# Altium schematic sheet ddr3.SchDoc
size A4; SheetNumber: 1; SheetTotal: 7
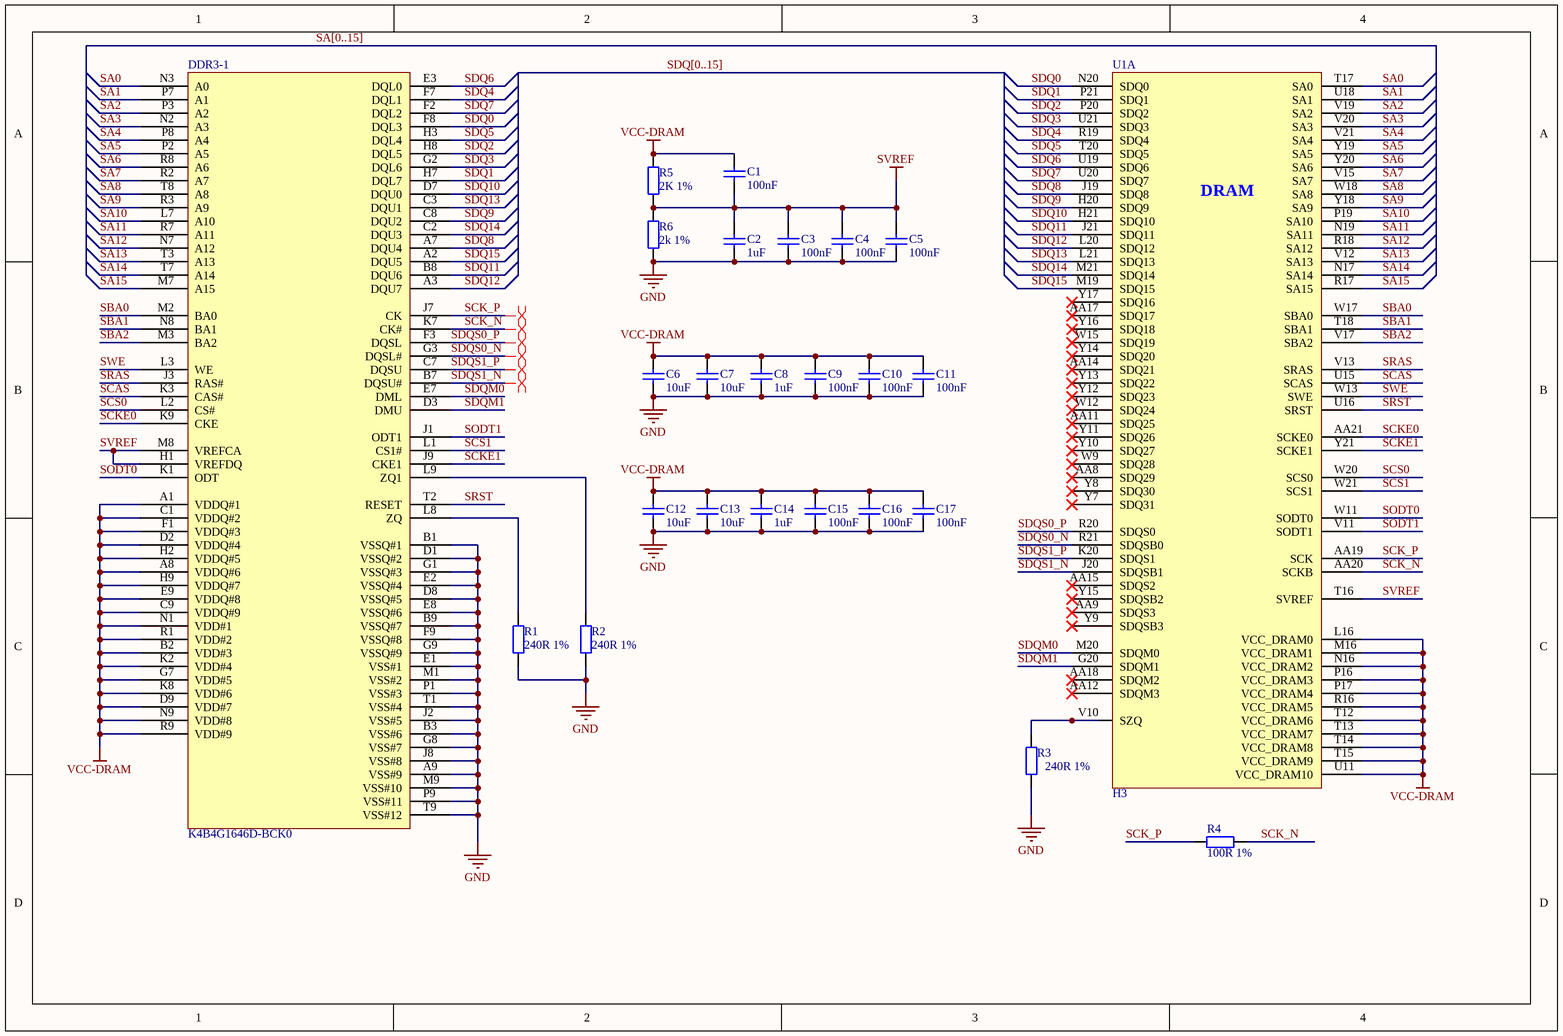
[diagram p0: ddr3.SchDoc]

## Parts
C1  100nF  [0402_C]
C2  1uF  [0402_C]
C3  100nF  [0402_C]
C4  100nF  [0402_C]
C5  100nF  [0402_C]
C6  10uF  [0402_C]
C7  10uF  [0402_C]
C8  1uF  [0402_C]
C9  100nF  [0402_C]
C10  100nF  [0402_C]
C11  100nF  [0402_C]
C12  10uF  [0402_C]
C13  10uF  [0402_C]
C14  1uF  [0402_C]
C15  100nF  [0402_C]
C16  100nF  [0402_C]
C17  100nF  [0402_C]
DDR3-1  K4B4G1646D-BCK0  [BGA96_DDR3]
R1  240R 1%  [0402_R]
R2  240R 1%  [0402_R]
R3  240R 1%  [0402_R]
R4  100R 1%  [0402_R]
R5  2K 1%  [0402_R]
R6  2k 1%  [0402_R]
U1  H3  [allwinner-h3]  (part A of 9)

## Nets
GND: C2.2 C3.2 C4.2 C5.2 C6.2 C7.2 C8.2 C9.2 C10.2 C11.2 C12.2 C13.2 C14.2 C15.2 C16.2 C17.2 DDR3-1.A9(VSS#9) DDR3-1.B1(VSSQ#1) DDR3-1.B3(VSS#6) DDR3-1.B9(VSSQ#7) DDR3-1.D1(VSSQ#2) DDR3-1.D8(VSSQ#5) DDR3-1.E1(VSS#1) DDR3-1.E2(VSSQ#4) DDR3-1.E8(VSSQ#6) DDR3-1.F9(VSSQ#8) DDR3-1.G1(VSSQ#3) DDR3-1.G8(VSS#7) DDR3-1.G9(VSSQ#9) DDR3-1.J2(VSS#5) DDR3-1.J8(VSS#8) DDR3-1.M1(VSS#2) DDR3-1.M9(VSS#10) DDR3-1.P1(VSS#3) DDR3-1.P9(VSS#11) DDR3-1.T1(VSS#4) DDR3-1.T9(VSS#12) R1.1 R2.1 R3.1 R6.2
SVREF: C1.2 C2.1 C3.1 C4.1 C5.1 DDR3-1.H1(VREFDQ) DDR3-1.M8(VREFCA) R5.1 R6.1 U1.T16(SVREF)
VCC-DRAM: C1.1 C6.1 C7.1 C8.1 C9.1 C10.1 C11.1 C12.1 C13.1 C14.1 C15.1 C16.1 C17.1 DDR3-1.A1(VDDQ#1) DDR3-1.A8(VDDQ#6) DDR3-1.B2(VDD#3) DDR3-1.C1(VDDQ#2) DDR3-1.C9(VDDQ#9) DDR3-1.D2(VDDQ#4) DDR3-1.D9(VDD#7) DDR3-1.E9(VDDQ#8) DDR3-1.F1(VDDQ#3) DDR3-1.G7(VDD#5) DDR3-1.H2(VDDQ#5) DDR3-1.H9(VDDQ#7) DDR3-1.K2(VDD#4) DDR3-1.K8(VDD#6) DDR3-1.N1(VDD#1) DDR3-1.N9(VDD#8) DDR3-1.R1(VDD#2) DDR3-1.R9(VDD#9) R5.2 U1.L16(VCC_DRAM0) U1.M16(VCC_DRAM1) U1.N16(VCC_DRAM2) U1.P16(VCC_DRAM3) U1.P17(VCC_DRAM4) U1.R16(VCC_DRAM5) U1.T12(VCC_DRAM6) U1.T13(VCC_DRAM7) U1.T14(VCC_DRAM8) U1.T15(VCC_DRAM9) U1.U11(VCC_DRAM10)
SA0: DDR3-1.N3(A0) U1.T17(SA0)
SA1: DDR3-1.P7(A1) U1.U18(SA1)
SA2: DDR3-1.P3(A2) U1.V19(SA2)
SA3: DDR3-1.N2(A3) U1.V20(SA3)
SA4: DDR3-1.P8(A4) U1.V21(SA4)
SA5: DDR3-1.P2(A5) U1.Y19(SA5)
SA6: DDR3-1.R8(A6) U1.Y20(SA6)
SA7: DDR3-1.R2(A7) U1.V15(SA7)
SA8: DDR3-1.T8(A8) U1.W18(SA8)
SA9: DDR3-1.R3(A9) U1.Y18(SA9)
SA10: DDR3-1.L7(A10) U1.P19(SA10)
SA11: DDR3-1.R7(A11) U1.N19(SA11)
SA12: DDR3-1.N7(A12) U1.R18(SA12)
SA13: DDR3-1.T3(A13) U1.V12(SA13)
SA14: DDR3-1.T7(A14) U1.N17(SA14)
SA15: DDR3-1.M7(A15) U1.R17(SA15)
SBA0: DDR3-1.M2(BA0) U1.W17(SBA0)
SBA1: DDR3-1.N8(BA1) U1.T18(SBA1)
SBA2: DDR3-1.M3(BA2) U1.V17(SBA2)
SCAS: DDR3-1.K3(CAS#) U1.U15(SCAS)
SCK_N: DDR3-1.K7(CK#) R4.2 U1.AA20(SCKB)
SCK_P: DDR3-1.J7(CK) R4.1 U1.AA19(SCK)
SCKE0: DDR3-1.K9(CKE) U1.AA21(SCKE0)
SCKE1: DDR3-1.J9(CKE1) U1.Y21(SCKE1)
SCS0: DDR3-1.L2(CS#) U1.W20(SCS0)
SCS1: DDR3-1.L1(CS1#) U1.W21(SCS1)
SDQ0: DDR3-1.F8(DQL3) U1.N20(SDQ0)
SDQ1: DDR3-1.H7(DQL7) U1.P21(SDQ1)
SDQ2: DDR3-1.H8(DQL5) U1.P20(SDQ2)
SDQ3: DDR3-1.G2(DQL6) U1.U21(SDQ3)
SDQ4: DDR3-1.F7(DQL1) U1.R19(SDQ4)
SDQ5: DDR3-1.H3(DQL4) U1.T20(SDQ5)
SDQ6: DDR3-1.E3(DQL0) U1.U19(SDQ6)
SDQ7: DDR3-1.F2(DQL2) U1.U20(SDQ7)
SDQ8: DDR3-1.A7(DQU4) U1.J19(SDQ8)
SDQ9: DDR3-1.C8(DQU2) U1.H20(SDQ9)
SDQ10: DDR3-1.D7(DQU0) U1.H21(SDQ10)
SDQ11: DDR3-1.B8(DQU6) U1.J21(SDQ11)
SDQ12: DDR3-1.A3(DQU7) U1.L20(SDQ12)
SDQ13: DDR3-1.C3(DQU1) U1.L21(SDQ13)
SDQ14: DDR3-1.C2(DQU3) U1.M21(SDQ14)
SDQ15: DDR3-1.A2(DQU5) U1.M19(SDQ15)
SDQM0: DDR3-1.E7(DML) U1.M20(SDQM0)
SDQM1: DDR3-1.D3(DMU) U1.G20(SDQM1)
SDQS0_N: DDR3-1.G3(DQSL#) U1.R21(SDQSB0)
SDQS0_P: DDR3-1.F3(DQSL) U1.R20(SDQS0)
SDQS1_N: DDR3-1.B7(DQSU#) U1.J20(SDQSB1)
SDQS1_P: DDR3-1.C7(DQSU) U1.K20(SDQS1)
SODT0: DDR3-1.K1(ODT) U1.W11(SODT0)
SODT1: DDR3-1.J1(ODT1) U1.V11(SODT1)
SRAS: DDR3-1.J3(RAS#) U1.V13(SRAS)
SRST: DDR3-1.T2(RESET) U1.U16(SRST)
SWE: DDR3-1.L3(WE) U1.W13(SWE)
NetDDR3-1_L8: DDR3-1.L8(ZQ) R1.2
NetDDR3-1_L9: DDR3-1.L9(ZQ1) R2.2
NetR3_2: R3.2 U1.V10(SZQ)

Not connected (* = marked no-connect by the designer): U1 AA8(SDQ29)* AA9(SDQS3)* AA11(SDQ25)* AA12(SDQM3)* AA14(SDQ21)* AA15(SDQS2)* AA17(SDQ17)* AA18(SDQM2)* W9(SDQ28)* W12(SDQ24)* W15(SDQ19)* Y7(SDQ31)* Y8(SDQ30)* Y9(SDQSB3)* Y10(SDQ27)* Y11(SDQ26)* Y12(SDQ23)* Y13(SDQ22)* Y14(SDQ20)* Y15(SDQSB2)* Y16(SDQ18)* Y17(SDQ16)*

## Buses and harness runs
bus SA[0..15]
bus SDQ[0..15]

## Layout directives
differential pair: SCK_N, SCK_P, SDQS0_N, SDQS0_P, SDQS1_N, SDQS1_P

## Notes on the sheet
- (in symbol H3_CPU, part A) DRAM

## Library data of the parts
C1-C17 = CAP-SMD: smd capacitor
DDR3-1 = DDR3-96pin: ddr3 96 BGA
R1-R6 = RES-SMD: smd resistor
U1 = H3_CPU: CPU